# EAGLE schematic DIY_037 (EAGLE 6.4)
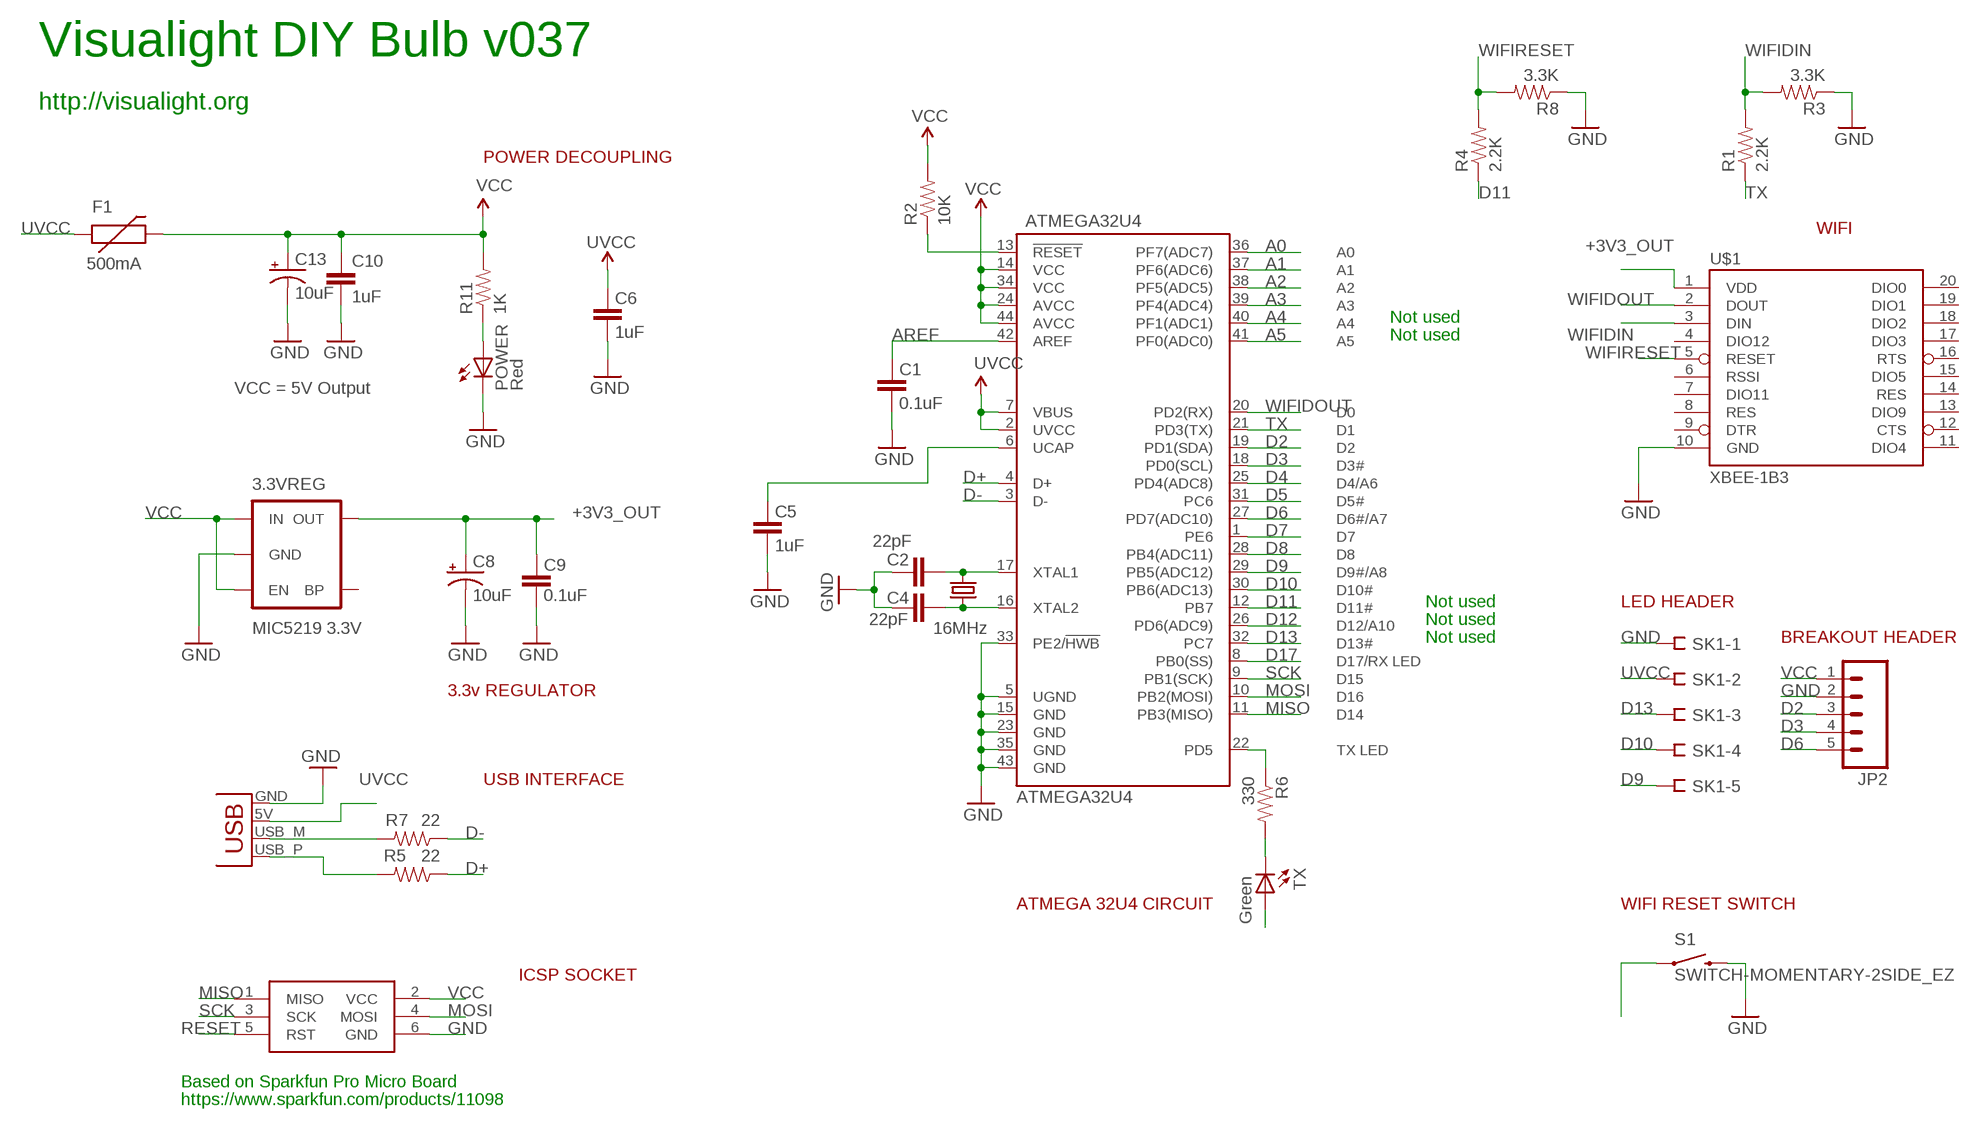
[diagram p0: schematic, sheet 1]

## Parts
3.3VREG  MIC5219 3.3V  V_REG_MIC52193.3V  [SOT23-5]
ATMEGA32U4  ATMEGA32U4  ATMEGA32U4TQFP  [SPARKFUN-DIGITALIC_TQFP44]
C1  0.1uF  CAP0402-CAP  [0402-CAP]
C2  22pF  CAP0402-CAP  [0402-CAP]
C4  22pF  CAP0402-CAP  [0402-CAP]
C5  1uF  CAP0402-CAP  [0402-CAP]
C6  1uF  CAP0402-CAP  [0402-CAP]
C8  10uF  CAP_POL1206  [EIA3216]
C9  0.1uF  CAP0402-CAP  [0402-CAP]
C10  1uF  CAP0402-CAP  [0402-CAP]
C13  10uF  CAP_POL1206  [EIA3216]
F1  500mA  PTCSMD  [PTC-1206]
ISP1  AVRISP-6  [AVRISP]
JP2  M05PTH  [1X05]
POWER  Red  LED0603  [LED-0603]
R1  2.2K  RESISTOR0402-RES  [0402-RES]
R2  10K  RESISTOR0402-RES  [0402-RES]
R3  3.3K  RESISTOR0402-RES  [0402-RES]
R4  2.2K  RESISTOR0402-RES  [0402-RES]
R5  22  RESISTOR0402-RES  [0402-RES]
R6  330  RESISTOR0402-RES  [0402-RES]
R7  22  RESISTOR0402-RES  [0402-RES]
R8  3.3K  RESISTOR0402-RES  [0402-RES]
R11  1K  RESISTOR0402-RES  [0402-RES]
S1  SWITCH-MOMENTARY-2SIDE_EZ  [TACTILE-PTH-SIDEEZ]
SK1  DF3-05S  [DF3S-05]
TX  Green  LED0603  [LED-0603]
U$1  XBEE-1B3  [XBEE-SMD]
X2  USBPCB  [USB-A-PCB]
Y1  16MHz  CRYSTAL5X3  [CRYSTAL-SMD-5X3]

## Nets
+3V3_OUT: 3.3VREG.5(OUT) C8.A(+) C9.2 U$1.1(VDD)
A0: ATMEGA32U4.36(PF7(ADC7))
A1: ATMEGA32U4.37(PF6(ADC6))
A2: ATMEGA32U4.38(PF5(ADC5))
A3: ATMEGA32U4.39(PF4(ADC4))
A4: ATMEGA32U4.40(PF1(ADC1))
A5: ATMEGA32U4.41(PF0(ADC0))
AREF: ATMEGA32U4.42(AREF) C1.2
D2: ATMEGA32U4.19(PD1(SDA)) JP2.3
D3: ATMEGA32U4.18(PD0(SCL)) JP2.4
D4: ATMEGA32U4.25(PD4(ADC8))
D5: ATMEGA32U4.31(PC6)
D6: ATMEGA32U4.27(PD7(ADC10)) JP2.5
D7: ATMEGA32U4.1(PE6) S1.1
D8: ATMEGA32U4.28(PB4(ADC11))
D9: ATMEGA32U4.29(PB5(ADC12)) SK1.5
D10: ATMEGA32U4.30(PB6(ADC13)) SK1.4
D11: ATMEGA32U4.12(PB7) R4.1
D12: ATMEGA32U4.26(PD6(ADC9))
D13: ATMEGA32U4.32(PC7) SK1.3
D17: ATMEGA32U4.8(PB0(SS))
D+: ATMEGA32U4.4(D+) R5.1
D-: ATMEGA32U4.3(D-) R7.1
GND [vcc]: 3.3VREG.2(GND) ATMEGA32U4.5(UGND) ATMEGA32U4.15(GND) ATMEGA32U4.23(GND) ATMEGA32U4.33(PE2/!HWB) ATMEGA32U4.35(GND) ATMEGA32U4.43(GND) C1.1 C2.2 C4.2 C5.1 C6.1 C8.C(-) C9.1 C10.2 C13.C(-) ISP1.6(GND) JP2.2 POWER.C R3.1 R8.1 S1.2 SK1.1 U$1.10(GND) X2.GND
MISO: ATMEGA32U4.11(PB3(MISO)) ISP1.1(MISO)
MOSI: ATMEGA32U4.10(PB2(MOSI)) ISP1.4(MOSI)
N$1: ATMEGA32U4.16(XTAL2) C4.1 Y1.1
N$2: ATMEGA32U4.17(XTAL1) C2.1 Y1.3
N$4: ATMEGA32U4.6(UCAP) C5.2
N$6: R7.2 X2.USB_M(D-)
N$7: R6.2 TX.C
N$8: R5.2 X2.USB_P(D+)
N$38: POWER.A R11.1
RESET: ATMEGA32U4.13(!RESET) ISP1.5(RST) R2.1
SCK: ATMEGA32U4.9(PB1(SCK)) ISP1.3(SCK)
TX: ATMEGA32U4.21(PD3(TX)) R1.1
TXLED: ATMEGA32U4.22(PD5) R6.1
UVCC: ATMEGA32U4.2(UVCC) ATMEGA32U4.7(VBUS) C6.2 F1.1 SK1.2 X2.5V(VBUS)
VCC: 3.3VREG.1(IN) 3.3VREG.3(EN) ATMEGA32U4.14(VCC) ATMEGA32U4.24(AVCC) ATMEGA32U4.34(VCC) ATMEGA32U4.44(AVCC) C10.1 C13.A(+) F1.2 ISP1.2(VCC) JP2.1 R2.2 R11.2 TX.A
WIFIDIN: R1.2 R3.2 U$1.3(DIN)
WIFIDOUT: ATMEGA32U4.20(PD2(RX)) U$1.2(DOUT)
WIFIRESET: R4.2 R8.2 U$1.5(RESET)
Unconnected: 3.3VREG.4(BP) U$1.4(DIO12) U$1.6(RSSI) U$1.7(DIO11) U$1.8(RES) U$1.9(DTR) U$1.11(DIO4) U$1.12(CTS) U$1.13(DIO9) U$1.14(RES) U$1.15(DIO5) U$1.16(RTS) U$1.17(DIO3) U$1.18(DIO2) U$1.19(DIO1) U$1.20(DIO0)

## Notes on the sheet
- Visualight DIY Bulb v037
- http://visualight.org
- POWER DECOUPLING
- WIFI
- Not used
- Not used
- VCC = 5V Output
- Not used | LED HEADER
- Not used
- Not used | BREAKOUT HEADER
- 3.3v REGULATOR
- USB INTERFACE
- ATMEGA 32U4 CIRCUIT | WIFI RESET SWITCH
- ICSP SOCKET
- Based on Sparkfun Pro Micro Board
- https://www.sparkfun.com/products/11098

## Library data of the parts
3.3VREG = SparkFun-PowerIC:V_REG_MIC5219: V_REG MIC5219 Standard 500mA LDO voltage regulator in SOT-23 layout. Micrel part MIC5219. BP (by-pass) pin is used to lower output noise with 470pF cap, may be left open.; PROD_ID: VREG-09872
ATMEGA32U4 = SparkFun-DigitalIC:ATMEGA32U4: Atmel 44-pin 8-bit Microcontroller with 32KBytes of ISP Flash and USB Controller
C1 C2 C4-C6 C9 C10 = SparkFun:CAP: Capacitor Standard 0603 ceramic capacitor, and 0.1" leaded capacitor.
C8 C13 = SparkFun:CAP_POL: Capacitor Polarized These are standard SMD and PTH capacitors. Normally 10uF, 47uF, and 100uF in electrolytic and tantalum varieties. Always verify the external diameter of the through hole cap, it varies with capacity, voltage, and manufacturer. The EIA devices should be standard.
F1 = SparkFun:PTC: Resettable Fuse PTC Resettable Fuse. Spark Fun Electronics SKU : COM-08357
ISP1 = adafruit:AVRISP: AVR ISP HEADER Standard 6 pin header for AVR programming
JP2 = SparkFun-Connectors:M05: Header 5 Standard 5-pin 0.1" header. Use with straight break away headers (SKU : PRT-00116), right angle break away headers (PRT-00553), swiss pins (PRT-00743), machine pins (PRT-00117), and female headers (PRT-00115). Molex polarized connector foot print use with SKU : PRT-08230 with associated crimp pins and housings.
POWER TX = SparkFun:LED: LEDs Standard schematic elements and footprints for 5mm, 3mm, 1206, and 0603 sized LEDs. 5mm - Spark Fun Electronics SKU : COM-00529 (and others)
R1-R8 R11 = SparkFun:RESISTOR: Resistor Basic schematic elements and footprints for 0603, 1206, and PTH resistors.
S1 = SparkFun-Electromechanical:SWITCH-MOMENTARY-2: Various NO switches- pushbuttons, reed, etc
SK1 = con-hirose-df3:DF3-05S: Single row female connector 2mm 5 way
U$1 = SparkFun-RF:XBEE-1: Xbee module footprints SMT header is CONN-09042.; PROD_ID: CONN-09042
X2 = SparkFun-Connectors:USB: USB Connectors USB-B-PTH is fully proven SKU : PRT-00139/CONN-08278 USB-miniB is fully proven SKU : PRT-00587 USB-A-PCB is untested. USB-A-H is throughly reviewed, but untested. Spark Fun Electronics SKU : PRT-00437 USB-B-SMT is throughly reviewed, but untested. Needs silkscreen touching up. USB-A-S has not been used/tested USB-MB-H has not been used/tested USB-MICROB has been used. CONN-09505
Y1 = SparkFun:CRYSTAL: Crystals Various standard crystals. Proven footprints. Spark Fun Electronics SKU : COM-00534

## Net classes
0 default: width 0.003 mm, drill 0.254 mm, clearance 0.152 mm